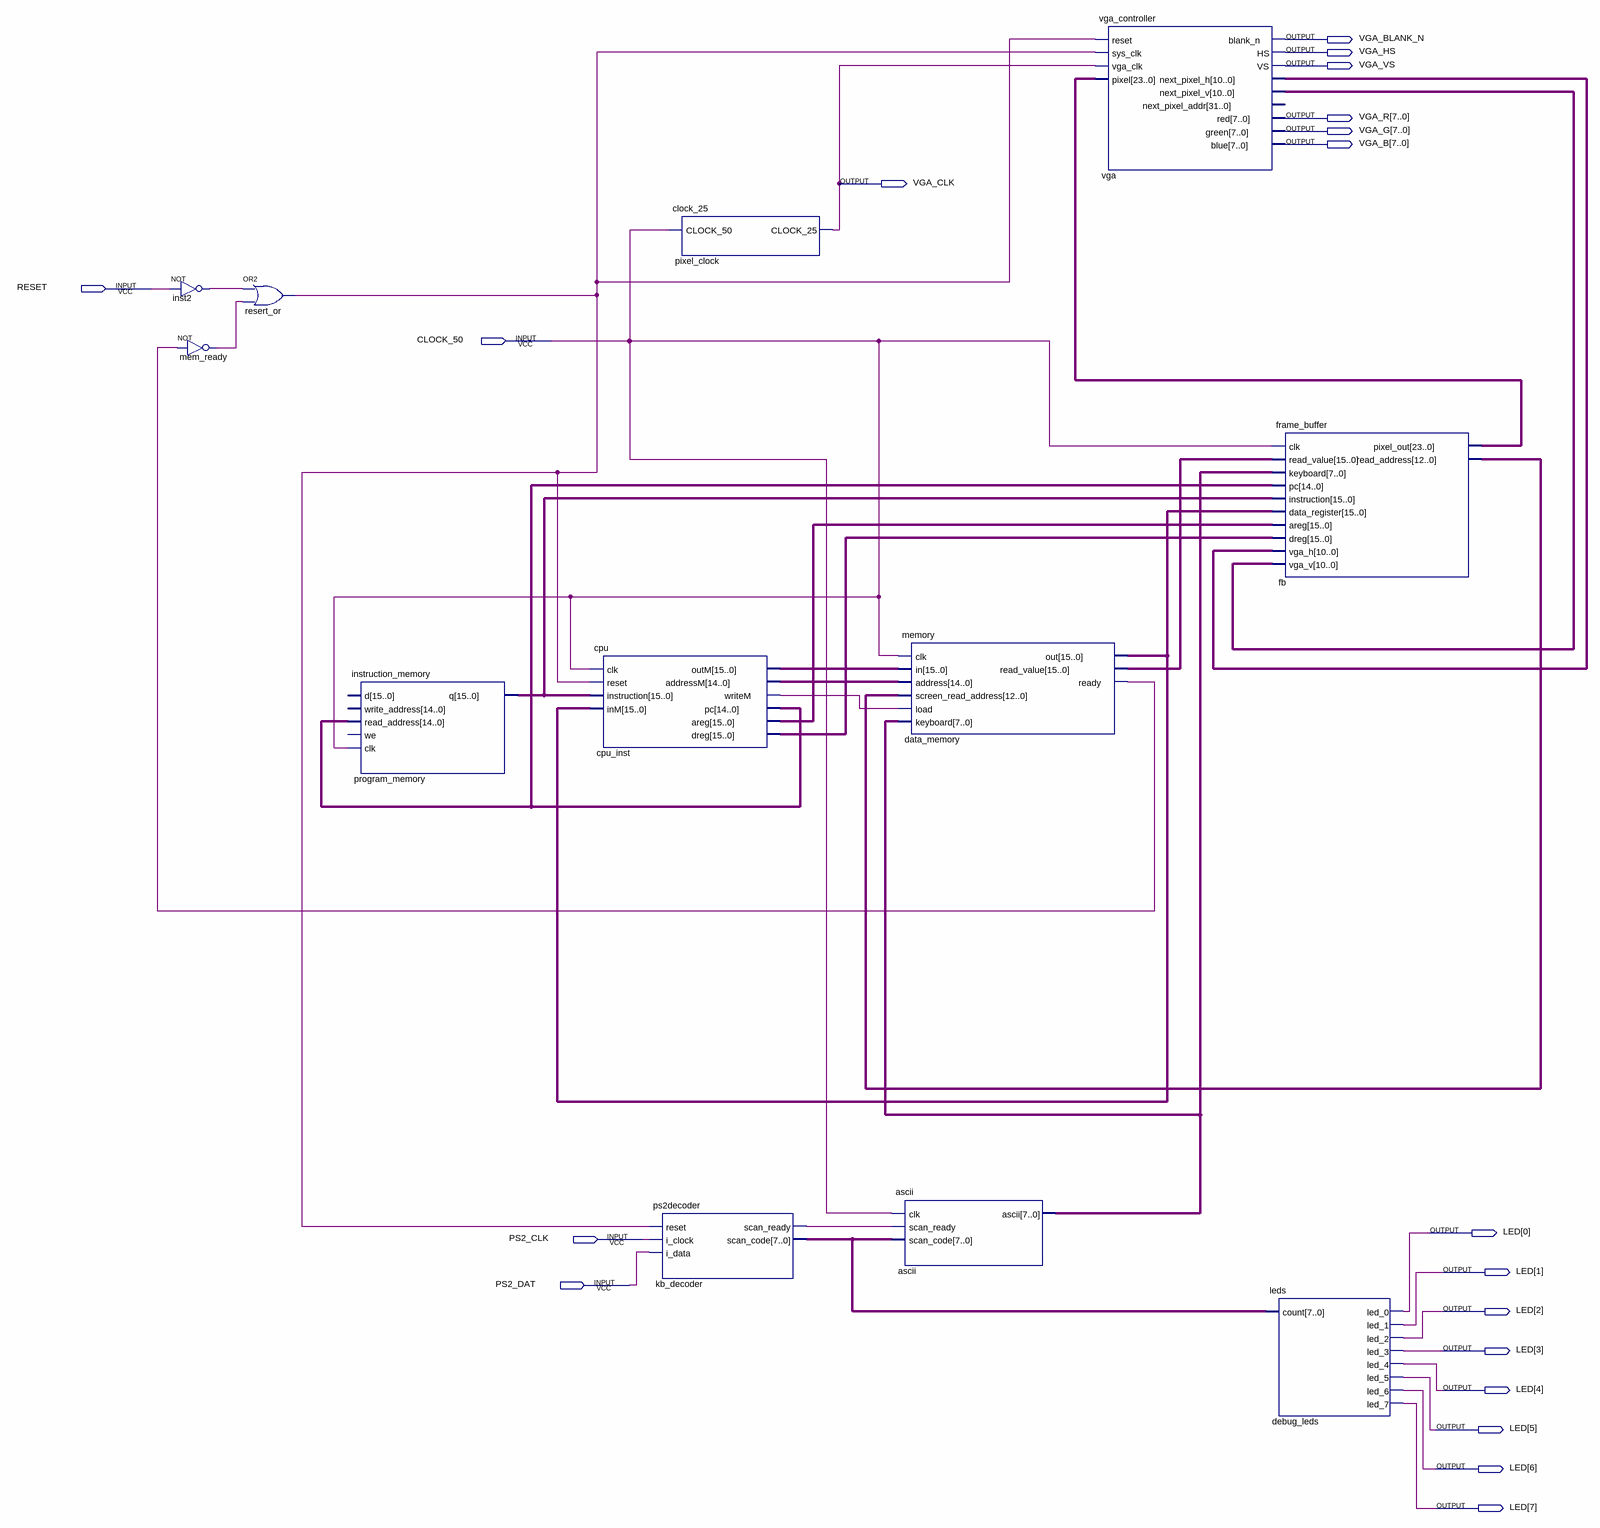
[diagram p0: schematic sheet]
// Quartus schematic hack.bdf as structural Verilog: 12 symbols, 19 pins
module hack (
  input  RESET,
  input  CLOCK_50,
  input  PS2_CLK,
  input  PS2_DAT,
  output VGA_BLANK_N,
  output VGA_HS,
  output VGA_VS,
  output [7:0] VGA_R,
  output [7:0] VGA_G,
  output [7:0] VGA_B,
  output VGA_CLK,
  output [7:0] LED
);

  wire cpu_inst_writem, data_memory_ready, inst2_out, kb_decoder_scan_ready, mem_ready_out, resert_or_out;
  wire [7:0] ascii_ascii, kb_decoder_scan_code;
  wire [10:0] vga_next_pixel_h, vga_next_pixel_v;
  wire [12:0] fb_read_address;
  wire [14:0] cpu_inst_addressm, cpu_inst_pc;
  wire [15:0] cpu_inst_areg, cpu_inst_dreg, cpu_inst_outm, data_memory_out, data_memory_read_value,
       program_memory_q;
  wire [23:0] fb_pixel_out;

  not inst2 (inst2_out, RESET);
  not mem_ready (mem_ready_out, data_memory_ready);
  or resert_or (resert_or_out, inst2_out, mem_ready_out);
  instruction_memory program_memory (
    .read_address(cpu_inst_pc), .clk(CLOCK_50), .q(program_memory_q));  // open: d, write_address, we
  cpu cpu_inst (
    .clk(CLOCK_50), .reset(resert_or_out), .instruction(program_memory_q), .inM(data_memory_out),
    .outM(cpu_inst_outm), .addressM(cpu_inst_addressm), .writeM(cpu_inst_writem), .pc(cpu_inst_pc),
    .areg(cpu_inst_areg), .dreg(cpu_inst_dreg));
  clock_25 pixel_clock (.CLOCK_50(CLOCK_50), .CLOCK_25(VGA_CLK));
  ps2decoder kb_decoder (
    .reset(resert_or_out), .i_clock(PS2_CLK), .i_data(PS2_DAT), .scan_ready(kb_decoder_scan_ready),
    .scan_code(kb_decoder_scan_code));
  memory data_memory (
    .clk(CLOCK_50), .in(cpu_inst_outm), .address(cpu_inst_addressm), .screen_read_address(fb_read_address),
    .load(cpu_inst_writem), .keyboard(ascii_ascii), .out(data_memory_out),
    .read_value(data_memory_read_value), .ready(data_memory_ready));
  ascii ascii (
    .clk(CLOCK_50), .scan_ready(kb_decoder_scan_ready), .scan_code(kb_decoder_scan_code), .ascii(ascii_ascii));
  vga_controller vga (
    .reset(resert_or_out), .sys_clk(resert_or_out), .vga_clk(VGA_CLK), .pixel(fb_pixel_out),
    .blank_n(VGA_BLANK_N), .HS(VGA_HS), .VS(VGA_VS), .next_pixel_h(vga_next_pixel_h),
    .next_pixel_v(vga_next_pixel_v), .red(VGA_R), .green(VGA_G), .blue(VGA_B));  // open: next_pixel_addr
  frame_buffer fb (
    .clk(CLOCK_50), .read_value(data_memory_read_value), .keyboard(ascii_ascii), .pc(cpu_inst_pc),
    .instruction(program_memory_q), .data_register(data_memory_out), .areg(cpu_inst_areg),
    .dreg(cpu_inst_dreg), .vga_h(vga_next_pixel_h), .vga_v(vga_next_pixel_v), .pixel_out(fb_pixel_out),
    .read_address(fb_read_address));
  leds debug_leds (
    .count(kb_decoder_scan_code), .led_0(LED[0]), .led_1(LED[1]), .led_2(LED[2]), .led_3(LED[3]),
    .led_4(LED[4]), .led_5(LED[5]), .led_6(LED[6]), .led_7(LED[7]));
endmodule
